# EAGLE design SWI_1_0 (EAGLE 7.6.0)
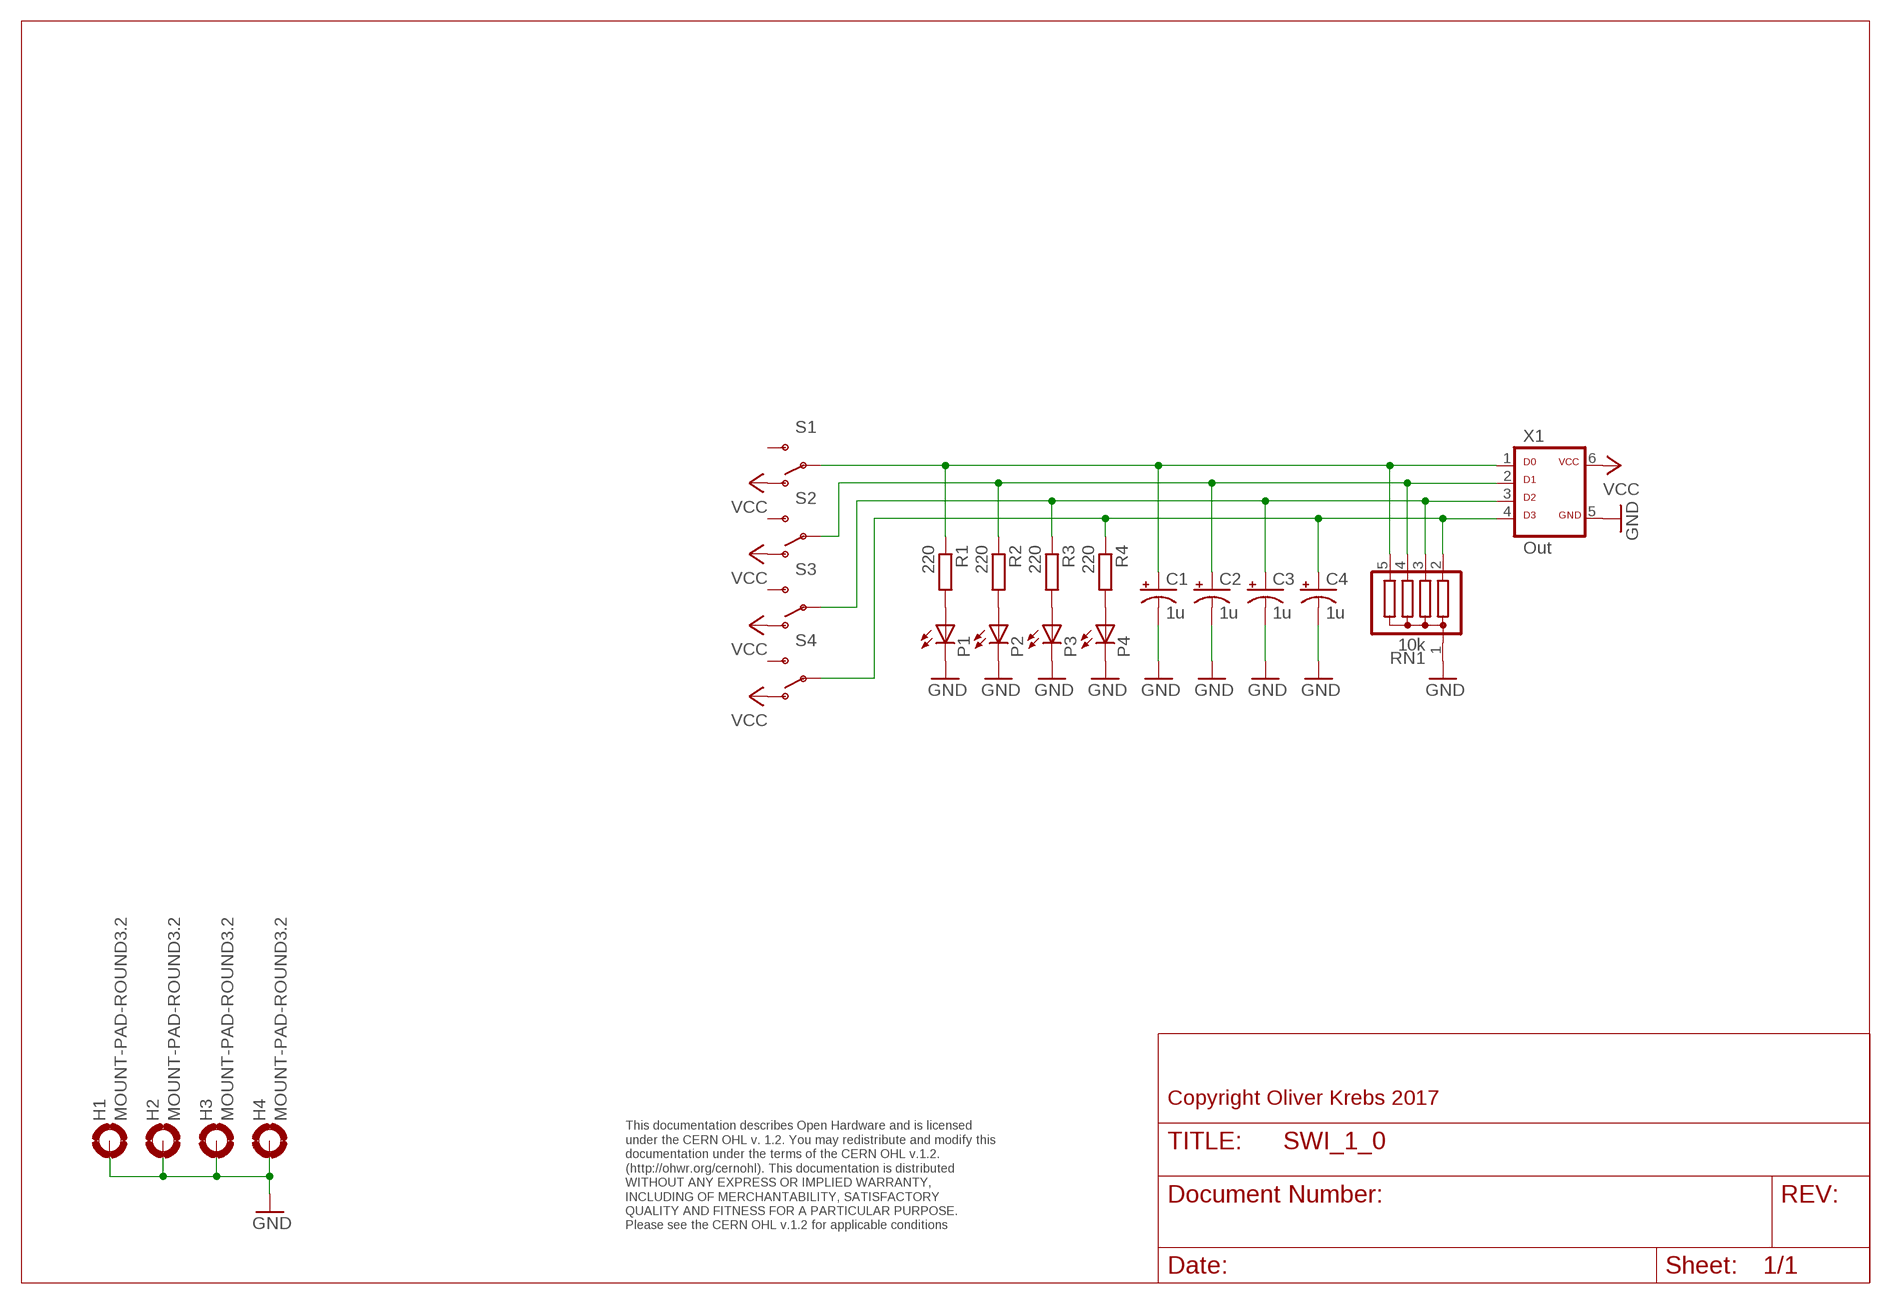
[diagram p0: schematic, sheet 1]

## Parts
C1  1u  CAP_POLPTH2  [CPOL-RADIAL-10UF-25V]
C2  1u  CAP_POLPTH2  [CPOL-RADIAL-10UF-25V]
C3  1u  CAP_POLPTH2  [CPOL-RADIAL-10UF-25V]
C4  1u  CAP_POLPTH2  [CPOL-RADIAL-10UF-25V]
H1  MOUNT-PAD-ROUND3.2  [3,2-PAD]
H2  MOUNT-PAD-ROUND3.2  [3,2-PAD]
H3  MOUNT-PAD-ROUND3.2  [3,2-PAD]
H4  MOUNT-PAD-ROUND3.2  [3,2-PAD]
P1  LED3MM  [LED3MM]
P2  LED3MM  [LED3MM]
P3  LED3MM  [LED3MM]
P4  LED3MM  [LED3MM]
R1  220  R-EU_0207/10  [0207/10]
R2  220  R-EU_0207/10  [0207/10]
R3  220  R-EU_0207/10  [0207/10]
R4  220  R-EU_0207/10  [0207/10]
RN1  10k  G04R  [SIL5]
S1  SWITCH-AS500APC  [SWITCH-AS500APC]
S2  SWITCH-AS500APC  [SWITCH-AS500APC]
S3  SWITCH-AS500APC  [SWITCH-AS500APC]
S4  SWITCH-AS500APC  [SWITCH-AS500APC]
X1  Out  ML6D  [ML-6]

## Nets
GND: C1.2(-) C2.2(-) C3.2(-) C4.2(-) H1.B3,2(MOUNT) H2.B3,2(MOUNT) H3.B3,2(MOUNT) H4.B3,2(MOUNT) P1.K(C) P2.K(C) P3.K(C) P4.K(C) RN1.1 X1.5
N$1: C1.1(+) R1.1 RN1.5 S1.P X1.1
N$2: C2.1(+) R2.1 RN1.4 S2.P X1.2
N$3: C3.1(+) R3.1 RN1.3 S3.P X1.3
N$4: C4.1(+) R4.1 RN1.2 S4.P X1.4
N$9: P1.A R1.2
N$10: P2.A R2.2
N$11: P3.A R3.2
N$12: P4.A R4.2
VCC: S1.O S2.O S3.O S4.O X1.6
Unconnected: S1.S S2.S S3.S S4.S

## Notes on the sheet
- Copyright Oliver Krebs 2017
- This documentation describes Open Hardware and is licensed 
  under the CERN OHL v. 1.2. You may redistribute and modify this 
  documentation under the terms of the CERN OHL v.1.2. 
  (http://ohwr.org/cernohl). This documentation is distributed
  WITHOUT ANY EXPRESS OR IMPLIED WARRANTY, 
  INCLUDING OF MERCHANTABILITY, SATISFACTORY 
  QUALITY AND FITNESS FOR A PARTICULAR PURPOSE. 
  Please see the CERN OHL v.1.2 for applicable conditions

## Library data of the parts
C1-C4 = SparkFun-Capacitors:CAP_POL: Capacitor Polarized These are standard SMD and PTH capacitors. Normally 10uF, 47uF, and 100uF in electrolytic and tantalum varieties. Always verify the external diameter of the through hole cap, it varies with capacity, voltage, and manufacturer. The EIA devices should be standard.
H1-H4 = holes:MOUNT-PAD-ROUND: MOUNTING PAD, round
P1-P4 = 01-my-led:LED: LED OSRAM: - CHIPLED LG R971, LG N971, LY N971, LG Q971, LY Q971, LO R971, LY R971 LH N974, LH R974 LS Q976, LO Q976, LY Q976 LO Q996 - Hyper CHIPLED LW Q18S LB Q993, LB Q99A, LB R99A - SideLED LS A670, LO A670, LY A670, LG A670, LP A670 LB A673, LV A673, LT A673, LW A673 LH A674 LY A675 LS A676, LA A676, LO A676, LY A676, LW A676 LS A679, LY A679, LG A679 - Hyper Micro SIDELED® LS Y876, LA Y876, LO Y876, LY Y876 LT Y87S - SmartLED LW L88C, LW L88S LB L89C, LB L89S, LG L890 LS L89K, LO L89K, LY L89K LS L896, LA L896, LO L896, LY L896 - TOPLED LS T670, LO T670, LY T670, LG T670, LP T670 LSG T670, LSP T670, LSY T670, LOP T670, LYG T670 LG T671, LOG T671, LSG T671 LB T673, LV T673, LT T673, LW T673 LH T674 LS T676, LA T676, LO T676, LY T676, LB T676, LH T676, LSB T676, LW T676 LB T67C, LV T67C, LT T67C, LS T67K, LO T67K, LY T67K, LW E67C LS E67B, LA E67B, LO E67B, LY E67B, LB E67C, LV E67C, LT E67C LW T67C LS T679, LY T679, LG T679 LS T770, LO T770, LY T770, LG T770, LP T770 LB T773, LV T773, LT T773, LW T773 LH T774 LS E675, LA E675, LY E675, LS T675 LS T776, LA T776, LO T776, LY T776, LB T776 LHGB T686 LT T68C, LB T68C - Hyper Mini TOPLED® LB M676 - Mini TOPLED Santana® LG M470 LS M47K, LO M47K, LY M47K Source: http://www.osram.convergy.de LUXEON: - LUMILED® LXK2-PW12-R00, LXK2-PW12-S00, LXK2-PW14-U00, LXK2-PW14-V00 LXK2-PM12-R00, LXK2-PM12-S00, LXK2-PM14-U00 LXK2-PE12-Q00, LXK2-PE12-R00, LXK2-PE12-S00, LXK2-PE14-T00, LXK2-PE14-U00 LXK2-PB12-K00, LXK2-PB12-L00, LXK2-PB12-M00, LXK2-PB14-N00, LXK2-PB14-P00, LXK2-PB14-Q00 LXK2-PR12-L00, LXK2-PR12-M00, LXK2-PR14-Q00, LXK2-PR14-R00 LXK2-PD12-Q00, LXK2-PD12-R00, LXK2-PD12-S00 LXK2-PH12-R00, LXK2-PH12-S00 LXK2-PL12-P00, LXK2-PL12-Q00, LXK2-PL12-R00 Source: www.luxeon.com KINGBRIGHT: KA-3528ASYC Source: www.kingbright.com
R1-R4 = 01-my_rcl:R-EU_: RESISTOR, European symbol
RN1 = resistor-sil:G04R: SIL RESISTOR; OC_FARNELL: unknown; OC_NEWARK: unknown
S1-S4 = SparkFun-Electromechanical:SWITCH-AS500APC
X1 = 01-my-con:ML6D

## Board
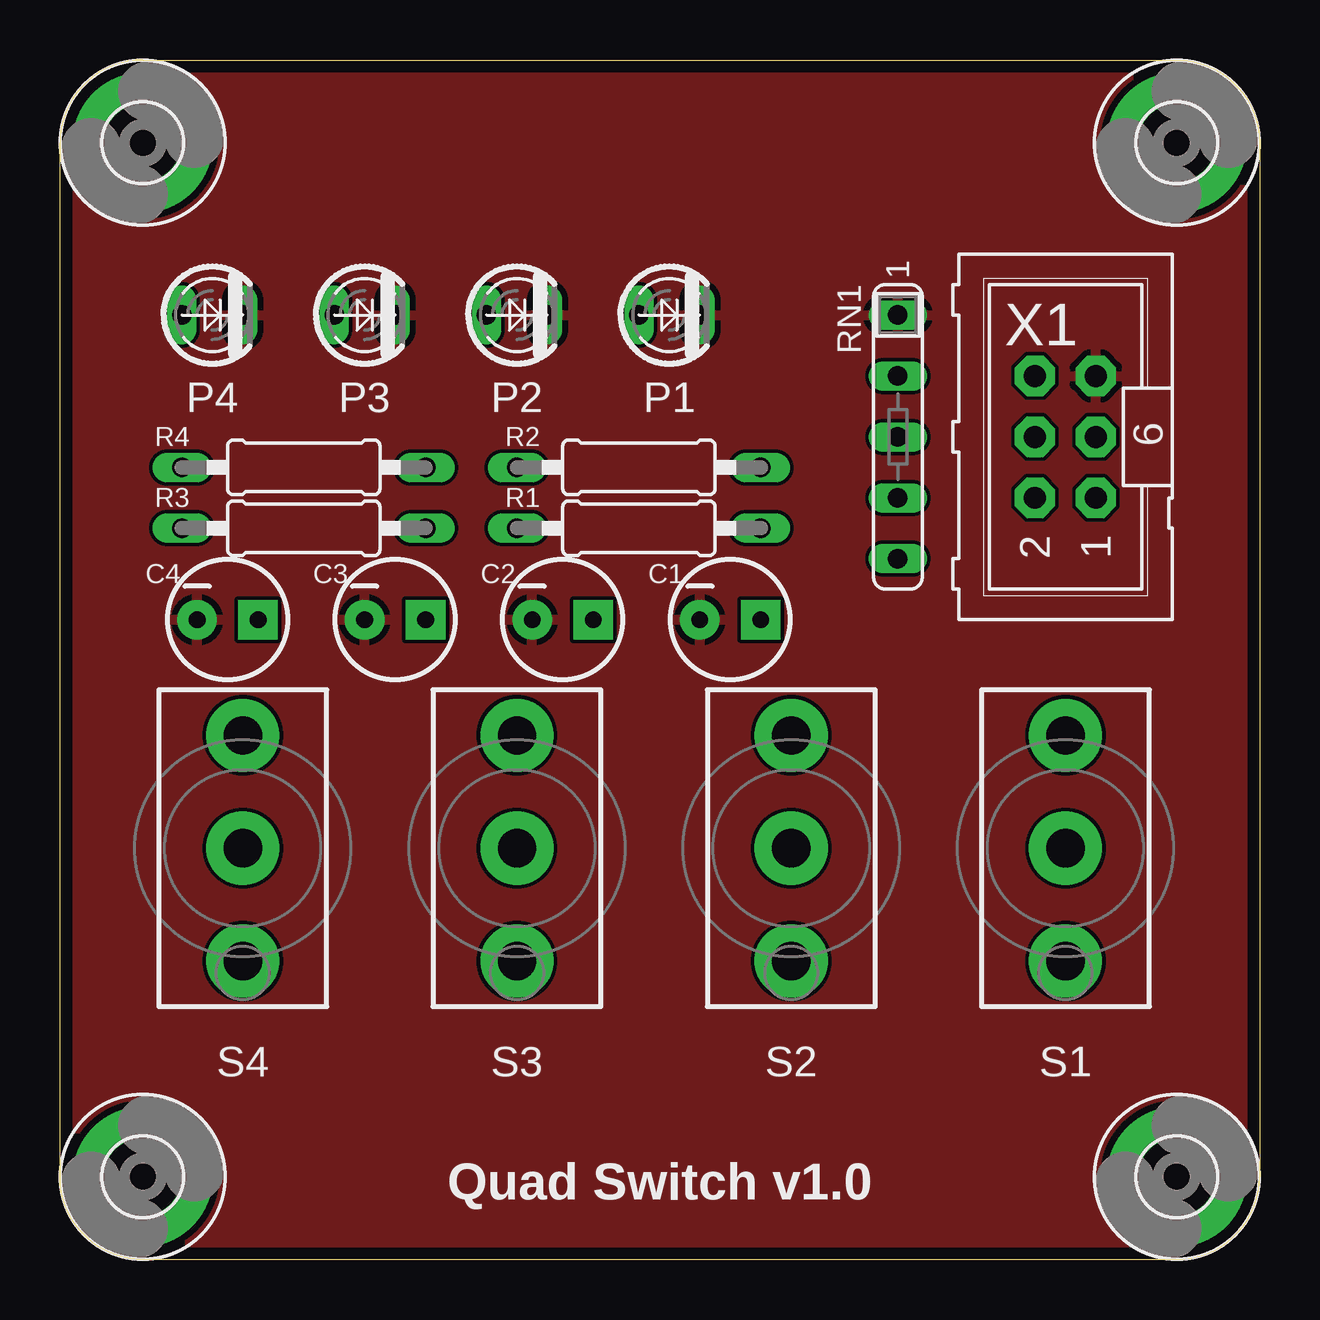
[diagram p1: board, top side]
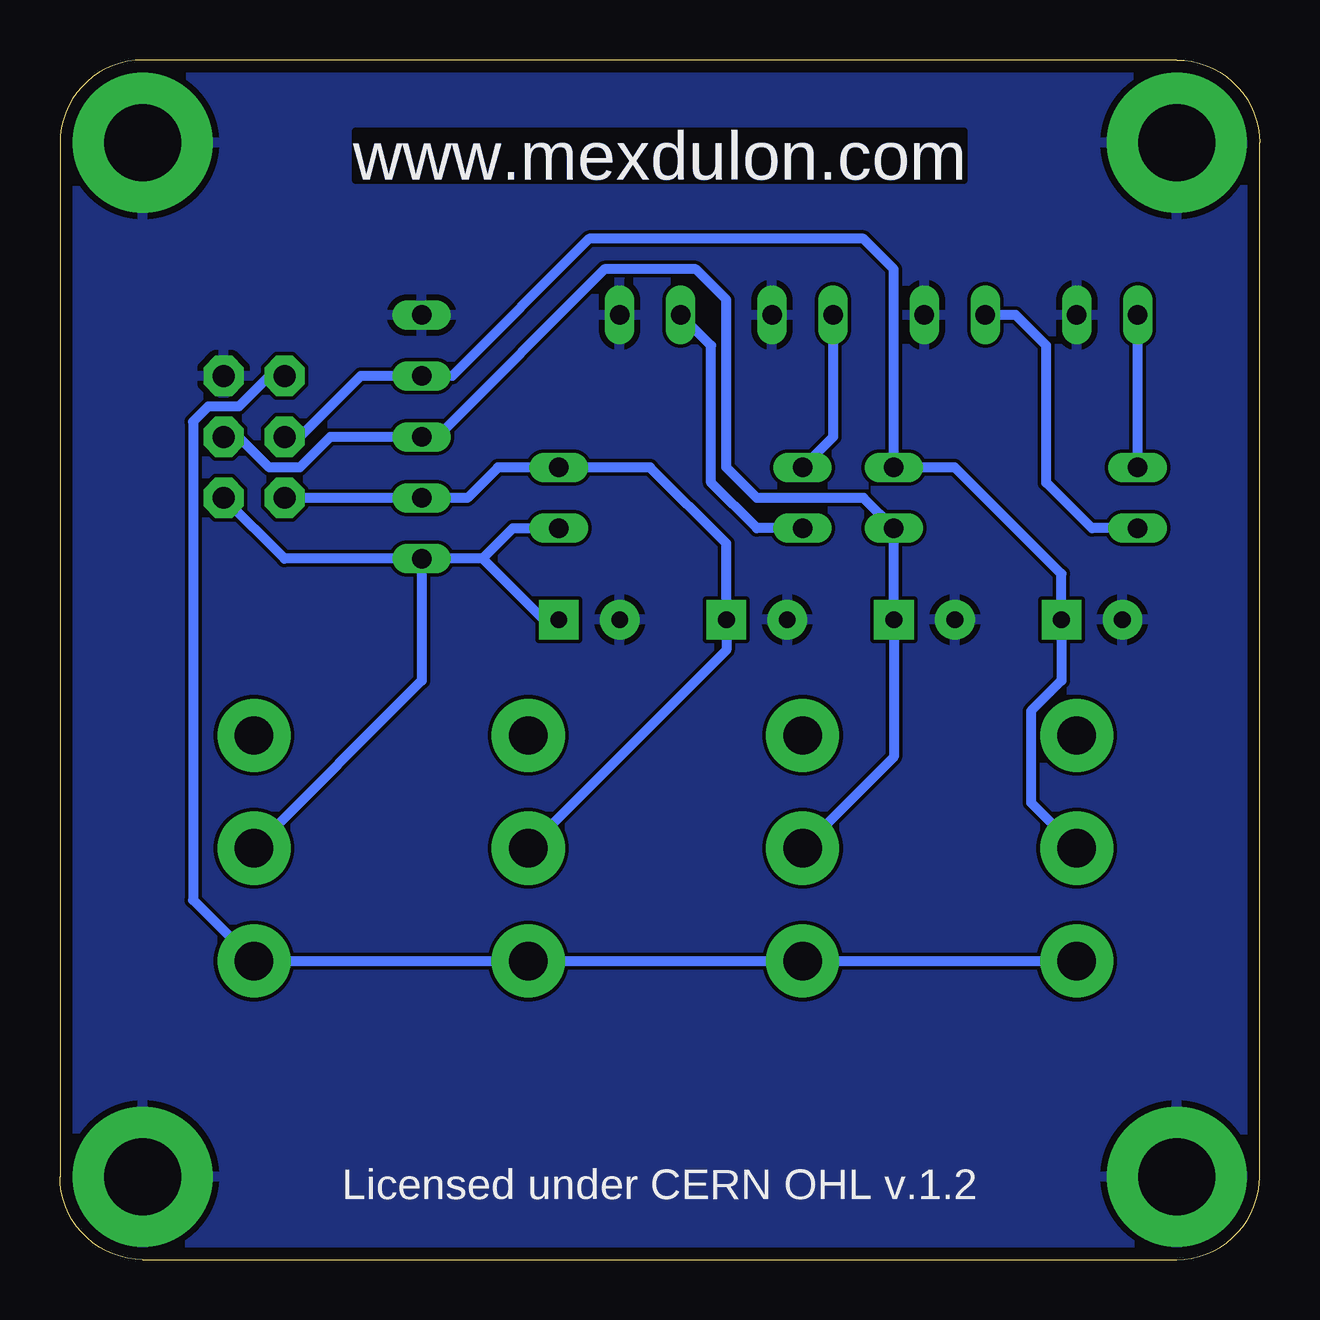
[diagram p2: board, bottom side, seen from below]

Size 50 x 50 mm. Coordinates in mm from the lower left corner, seen from the top.
Outline: 0,3.45 0,46.55 arc-90 3.45,50 46.55,50 arc-90 50,46.55 50,3.45 arc-90 46.55,0 3.45,0 arc-90 0,3.45
Copper layers (1*16): Top 0.035mm / dielectric 1.6mm / Bottom 0.035mm
Design rules "Elecrow_2-layer_PCB_eagle_rule": minimum track width 6mil, minimum drill 12mil, track to track 6mil, track to pad 6mil, pad to pad 6mil, via to via 8mil, smd to smd 0mil, copper to edge 20mil, drill to drill 10mil, minimum pad ring 6mil, minimum via ring 6mil, stop-mask expansion 0mil, vias tented up to drill 100mil, thermal gap 10mil

### Footprints (pad centres in the part's own frame; a part is rotated, then mirrored left to right if it is on the bottom)
CPOL-RADIAL-10UF-25V = drill 0.7 pad 1.651 square: 1 1.27,0 | drill 0.7 pad 1.651: 2 -1.27,0
3,2-PAD = drill 3.2 pad 5.842: B3,2 0,0
LED3MM = drill 0.813 long: A -1.27,0; K 1.27,0
0207/10 = drill 0.813 long: 1 -5.08,0; 2 5.08,0
SIL5 = drill 0.813 long: 1 -5.08,0; 2 -2.54,0; 3 0,0; 4 2.54,0; 5 5.08,0
SWITCH-AS500APC = drill 1.6 pad 3.048: O 0,4.7; P 0,0; S 0,-4.7
ML-6 = drill 0.914 pad 1.676 octagon: 1 -2.54,-1.27; 2 -2.54,1.27; 3 0,-1.27; 4 0,1.27; 5 2.54,-1.27; 6 2.54,1.27

### Placement (x,y rotation side)
C1  27.94,26.67 0 top
C2  20.95,26.67 0 top
C3  13.97,26.67 0 top
C4  6.99,26.67 0 top
H1  3.45,3.45 0 top
H2  3.45,46.55 0 top
H3  46.55,3.45 0 top
H4  46.55,46.55 0 top
P1  25.4,39.37 0 top
P2  19.05,39.37 0 top
P3  12.7,39.37 0 top
P4  6.35,39.37 0 top
R1  24.13,30.48 180 top
R2  24.13,33.02 180 top
R3  10.16,30.48 180 top
R4  10.16,33.02 180 top
RN1  34.92,34.29 270 top
S1  41.91,17.14 180 top
S2  30.48,17.14 180 top
S3  19.05,17.14 180 top
S4  7.62,17.14 180 top
X1  41.91,34.29 90 top

### Tracks (layer width: path | path; a pad name or v marks a point on that pad's centre or on a via)
GND
  pour Bottom: 0,0 50.8,0 50.8,50.8 0,50.8
  pour Top: 0,50.16 50.16,50.16 50.16,0 0,0
N$1
  Bottom 0.406: RN1.5 34.92,24.13 S1.P | C1.1 29.84,26.67 32.38,29.21 | 32.38,29.21 RN1.5 | 32.38,29.21 31.11,30.48 R1.1 | RN1.5 40.64,29.21 X1.1
N$2
  Bottom 0.406: S2.P 22.23,25.4 C2.1 22.23,29.84 25.4,33.02 R2.1 31.75,33.02 33.02,31.75 RN1.4 X1.2
N$3
  Bottom 0.406: S3.P 15.24,20.95 C3.1 R3.1 16.51,31.75 20.95,31.75 22.23,33.02 22.23,40.01 23.5,41.27 27.3,41.27 34.29,34.29 RN1.3 38.73,34.29 40.01,33.02 41.27,33.02 42.55,34.29 X1.3
N$4
  Bottom 0.406: S4.P 9.53,19.05 9.53,22.86 8.26,24.13 C4.1 8.26,28.57 12.7,33.02 R4.1 15.24,41.27 16.51,42.55 27.94,42.55 33.66,36.83 RN1.2 37.47,36.83 40.01,34.29 X1.4
N$9
  Bottom 0.406: R1.2 20.95,30.48 22.86,32.38 22.86,38.1 P1.A
N$10
  Bottom 0.406: P2.A 17.78,34.29 R2.2
N$11
  Bottom 0.406: R3.2 6.99,30.48 8.89,32.38 8.89,38.1 10.16,39.37 P3.A
N$12
  Bottom 0.406: R4.2 P4.A
VCC
  Bottom 0.406: X1.6 41.27,36.83 42.55,35.56 43.81,35.56 44.45,34.92 44.45,14.98 S1.O S2.O S3.O S4.O

### Text on the board
Bottom: www.mexdulon.com
tNames: Quad Switch v1.0
bNames: www.mexdulon.com | Licensed under CERN OHL v.1.2